# EAGLE design CSS811_BME280_Breakout (EAGLE 9.1.0)
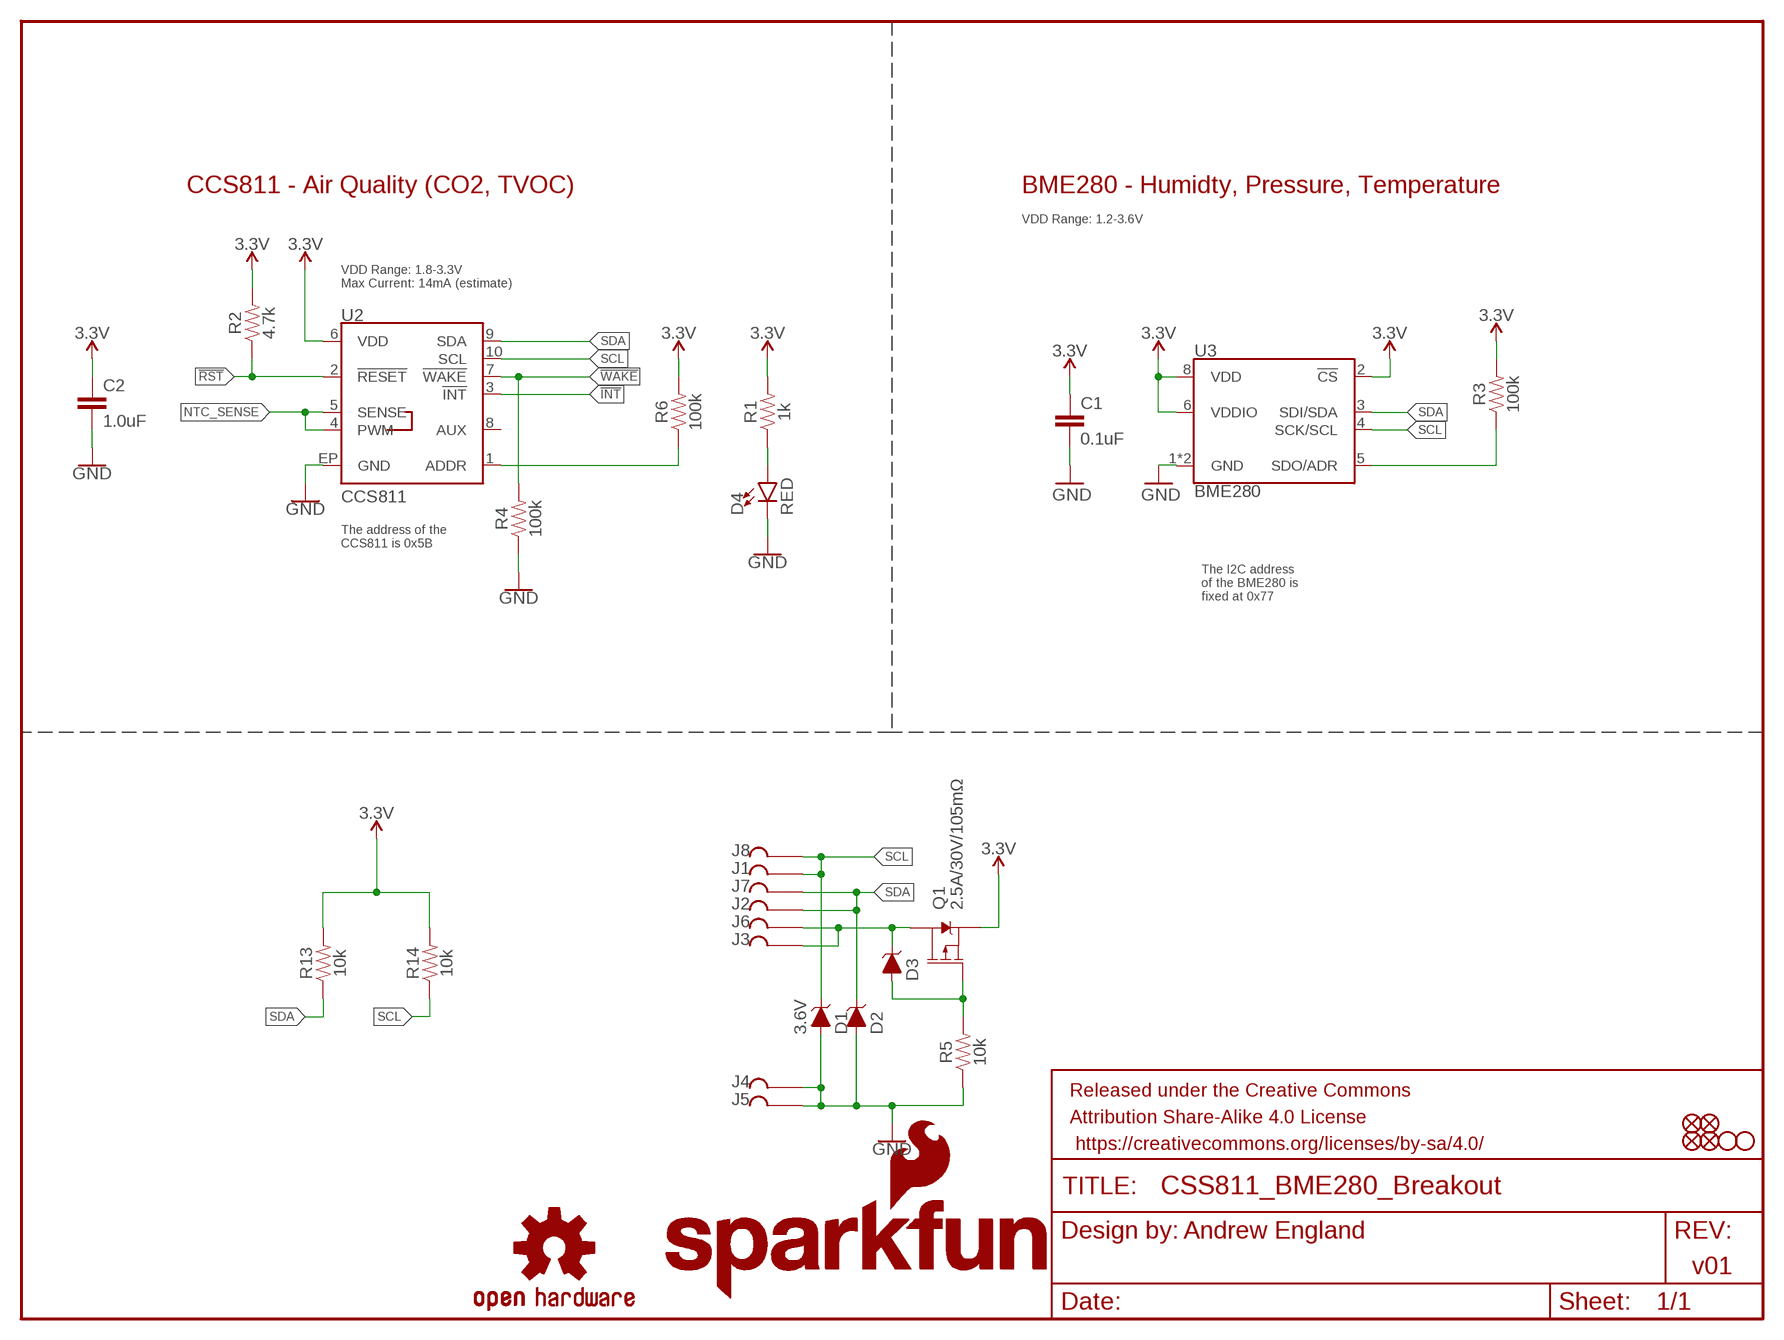
[diagram p0: schematic, sheet 1]

## Parts
C1  0.1uF  0.1UF-0603-25V-(+80/-20%)  [0603]
C2  1.0uF  1.0UF-0603-16V-10%  [0603]
D1  3.6V  DIODE-ZENER-BZT52C3V6S  [SOD-323]
D2  3.6V  DIODE-ZENER-BZT52C3V6S  [SOD-323]
D3  3.6V  DIODE-ZENER-BZT52C3V6S  [SOD-323]
D4  RED  LED-RED0603  [LED-0603]
FD1  FIDUCIAL1X2  [FIDUCIAL-1X2]
FD2  FIDUCIAL1X2  [FIDUCIAL-1X2]
FD3  FIDUCIAL1X2  [FIDUCIAL-1X2]
FD4  FIDUCIAL1X2  [FIDUCIAL-1X2]
FRAME1  FRAME-LETTER  [CREATIVE_COMMONS]
H2  STAND-OFF  [STAND-OFF]
H4  STAND-OFF  [STAND-OFF]
J1  GATORGATOR_MINI  [GATOR_MINI]
J2  GATORGATOR_MINI  [GATOR_MINI]
J3  GATORGATOR_MINI  [GATOR_MINI]
J4  GATORGATOR_MINI  [GATOR_MINI]
J5  GATORGATOR_MINI  [GATOR_MINI]
J6  GATORGATOR_MINI  [GATOR_MINI]
J7  GATORGATOR_MINI  [GATOR_MINI]
J8  GATORGATOR_MINI  [GATOR_MINI]
LOGO1  SFE_LOGO_NAME.1_INCH  [SFE_LOGO_NAME_.1]
LOGO2  SFE_LOGO_NAME_FLAME.1_INCH  [SFE_LOGO_NAME_FLAME_.1]
LOGO4  OSHW-LOGOS  [OSHW-LOGO-S]
Q1  2.5A/30V/105mΩ  MOSFET_PCH-DMG2307L  [SOT23-3]
R1  1k  1KOHM-0603-1/10W-1%  [0603]
R2  4.7k  4.7KOHM-0603-1/10W-1%  [0603]
R3  100k  100KOHM-0603-1/10W-1%  [0603]
R4  100k  100KOHM-0603-1/10W-1%  [0603]
R5  10k  10KOHM-0603-1/10W-1%  [0603]
R6  100k  100KOHM-0603-1/10W-1%  [0603]
R13  10k  10KOHM-0603-1/10W-1%  [0603]
R14  10k  10KOHM-0603-1/10W-1%  [0603]
U2  CCS811  CCS811PRODUCTION  [LGA10]
U3  BME280  [LGA-8-2.5X2.5]

## Nets
3.3V: C1.1 C2.1 Q1.2(S) R1.2 R2.2 R3.2 R6.2 R13.2 R14.2 U2.6(VDD) U3.2(!CS) U3.6(VDDIO) U3.8(VDD)
!INT: U2.3(!INT!)
!RST: R2.1 U2.2(!RESET!)
!WAKE: R4.2 U2.7(!WAKE!)
CCS811_ADDR: R6.1 U2.1(ADDR)
GND: C1.2 C2.2 D1.A D2.A D4.C J4.P$2 J5.P$2 R4.1 R5.1 U2.EP(GND) U3.1(GND) U3.7(GND)
N$2: D4.A R1.1
N$3: D3.C J3.P$2 J6.P$2 Q1.3(D)
N$4: D3.A Q1.1(G) R5.2
NTC_SENSE: U2.4(PWM) U2.5(SENSE)
SCL: D1.C J1.P$2 J8.P$2 R14.1 U2.10(SCL) U3.4(SCK/SCL)
SDA: D2.C J2.P$2 J7.P$2 R13.1 U2.9(SDA) U3.3(SDI/SDA)
SDO/ADR: R3.1 U3.5(SDO/ADR)
Unconnected: U2.8(AUX)

## Notes on the sheet
- CCS811 - Air Quality (CO2, TVOC) | BME280 - Humidty, Pressure, Temperature
- VDD Range: 1.2-3.6V
- VDD Range: 1.8-3.3V
  Max Current: 14mA (estimate)
- The address of the 
  CCS811 is 0x5B
- The I2C address
  of the BME280 is
  fixed at 0x77
- Andrew England
- v01

## Library data of the parts
C1 = SparkFun-Capacitors:0.1UF: 0.1µF ceramic capacitors A capacitor is a passive two-terminal electrical component used to store electrical energy temporarily in an electric field.; PROD_ID: CAP-00810
C2 = SparkFun-Capacitors:1.0UF: 1µF ceramic capacitors A capacitor is a passive two-terminal electrical component used to store electrical energy temporarily in an electric field.; PROD_ID: CAP-00868
D1-D3 = SparkFun-DiscreteSemi:DIODE-ZENER: Zener Diode A Zener diode allows current to flow from its anode to its cathode like a normal semiconductor diode, but it also permits current to flow in the reverse direction when its "Zener voltage" is reached. - WIkipedia; PROD_ID: DIO-08199
D4 = SparkFun-LED:LED-RED: Red SMD LED Used in manufacturing of most products at SparkFun Packages: 0603 - SMD 0603 package [Product Link] <http://docs.avagotech.com/docs/AV02-0551EN> 0603 SMART - SMD 0603 SMART package ( more efficient and expensive)[Product Link] <http://www.osram-os.com/Graphics/XPic2/00077099_0.pdf> 1206 - SMD1206 package [Product Link] <https://www.sparkfun.com/datasheets/DevTools/LilyPad/Q150OVS4.pdff> SparkFun Products: Pro Mini 328 -5V <https://www.sparkfun.com/products/821> RedBoard <https://www.sparkfun.com/products/12757> IOIO-OTG <https://www.sparkfun.com/products/13613>; PROD_ID: DIO-00819
FD1-FD4 = SparkFun-Aesthetics:FIDUCIAL: Fiducial Alignment Points Point-of-reference for pick-and-place machines and other optical instruments.
FRAME1 = SparkFun-Aesthetics:FRAME-LETTER: Schematic Frame - Letter Standard 8.5x11 US Letter frame
H2 H4 = SparkFun-Hardware:STAND-OFF: Stand Off Drill holes for mechanically mounting via screws, standoffs, etc. Note: Use the keepout ring to avoid running the screw head into surrounding components. Variant Overviews STAND-OFF - Mechanical footprint for a #4 phillips button head screw. STAND-OFF-TIGHT - Mechanical footprint for a #4 phillips button head screw, Example SparkFun Products Screw - Phillips Head (1/4", 4-40, 10 pack) <https://www.sparkfun.com/products/10453> (PRT-10453) Screw - Phillips Head (1/2", 4-40, 10 pack) <https://www.sparkfun.com/products/10452> (PRT-10452) Screw - Phillips Head (3/4", 4-40, 10 pack) <https://www.sparkfun.com/products/10451> (PRT-10451) Screw - Phillips Head (1", 4-40, 10 pack) <https://www.sparkfun.com/products/10450> (PRT-10450)
J1-J8 = SparkFun-Connectors:GATOR
LOGO1 = SparkFun-Aesthetics:SFE_LOGO_NAME: SparkFun Font Logo This is the SparkFun name logo. The logo on the schematic will always be the same size; the package variant is the height of the flame part of the logo (or the height the flame would be, if it were drawn). Default layer for the logo on the board is tSilk.
LOGO2 = SparkFun-Aesthetics:SFE_LOGO_NAME_FLAME: SparkFun Font Logo w/ Flame This is the SparkFun full logo. The logo on the schematic will always be the same size; the package variant is the height of the flame part of the logo. Default layer for the logo on the board is tSilk.
LOGO4 = SparkFun-Aesthetics:OSHW-LOGO: Open-Source Hardware (OSHW) Logo This logo indicates the piece of hardware it is found on incorporates a OSHW license and/or adheres to the definition of open source hardware found here: http://freedomdefined.org/OSHW
Q1 = SparkFun-DiscreteSemi:MOSFET_PCH: P-channel MOSFETs Voltage controlled devices that allow control of high current outputs. SparkFun Products: SparkFun ESP32 Thing <https://www.sparkfun.com/products/13907> SparkFun ESP8266 Thing <https://www.sparkfun.com/products/13231>; PROD_ID: TRANS-11308
R1 = SparkFun-Resistors:1KOHM: 1kΩ resistor A resistor is a passive two-terminal electrical component that implements electrical resistance as a circuit element. Resistors act to reduce current flow, and, at the same time, act to lower voltage levels within circuits. - Wikipedia; PROD_ID: RES-07856
R2 = SparkFun-Resistors:4.7KOHM: 4.7kΩ resistor A resistor is a passive two-terminal electrical component that implements electrical resistance as a circuit element. Resistors act to reduce current flow, and, at the same time, act to lower voltage levels within circuits. - Wikipedia; PROD_ID: RES-07857
R3 R4 R6 = SparkFun-Resistors:100KOHM: 100kΩ resistor A resistor is a passive two-terminal electrical component that implements electrical resistance as a circuit element. Resistors act to reduce current flow, and, at the same time, act to lower voltage levels within circuits. - Wikipedia; PROD_ID: RES-07828
R5 R13 R14 = SparkFun-Resistors:10KOHM: 10kΩ resistor A resistor is a passive two-terminal electrical component that implements electrical resistance as a circuit element. Resistors act to reduce current flow, and, at the same time, act to lower voltage levels within circuits. - Wikipedia; PROD_ID: RES-00824
U2 = SparkFun-Sensors:CCS811: AMS CCS811 – I2C Digital Gas Sensor Ultra-Low Power Digital Gas Sensor for Monitoring Indoor Air Quality AMS Product Page <http://ams.com/eng/Products/Environmental-Sensors/Gas-Sensors/CCS811> SparkFun Products:; PROD_ID: IC-13607
U3 = SparkFun-Sensors:BME280: Bosch BME280 – Combined Humidity and Pressure Sensor The BME280 is as combined digital humidity, pressure and temperature sensor based on proven sensing principles. The sensor module is housed in an extremely compact metal-lid LGA package with a footprint of only 2.5×2.5mm² with a height of 0.93mm. Its small dimensions and its low power consumption allow the implementation in battery driven devices such as handsets, GPS modules or watches. Datasheet <https://cdn.sparkfun.com/assets/learn_tutorials/4/1/9/BST-BME280_DS001-10.pdf> SparkFun Products SparkFun Atmospheric Sensor Breakout - BME280 <https://www.sparkfun.com/products/13676> (SEN-13676); PROD_ID: IC-13090

## Board
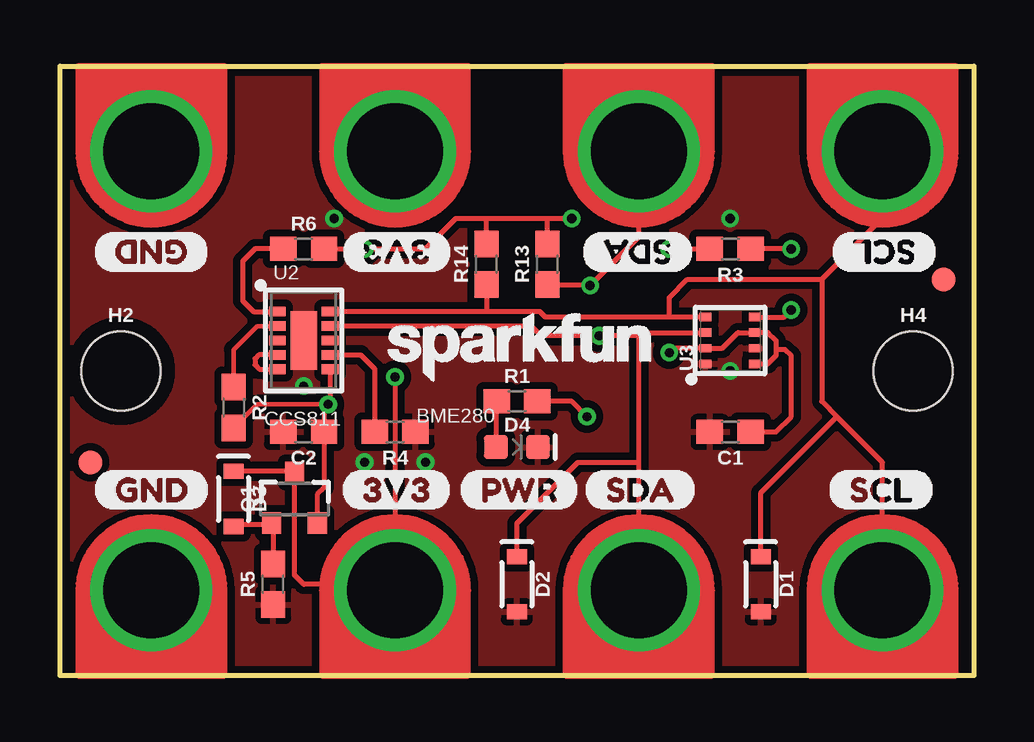
[diagram p1: board, top side]
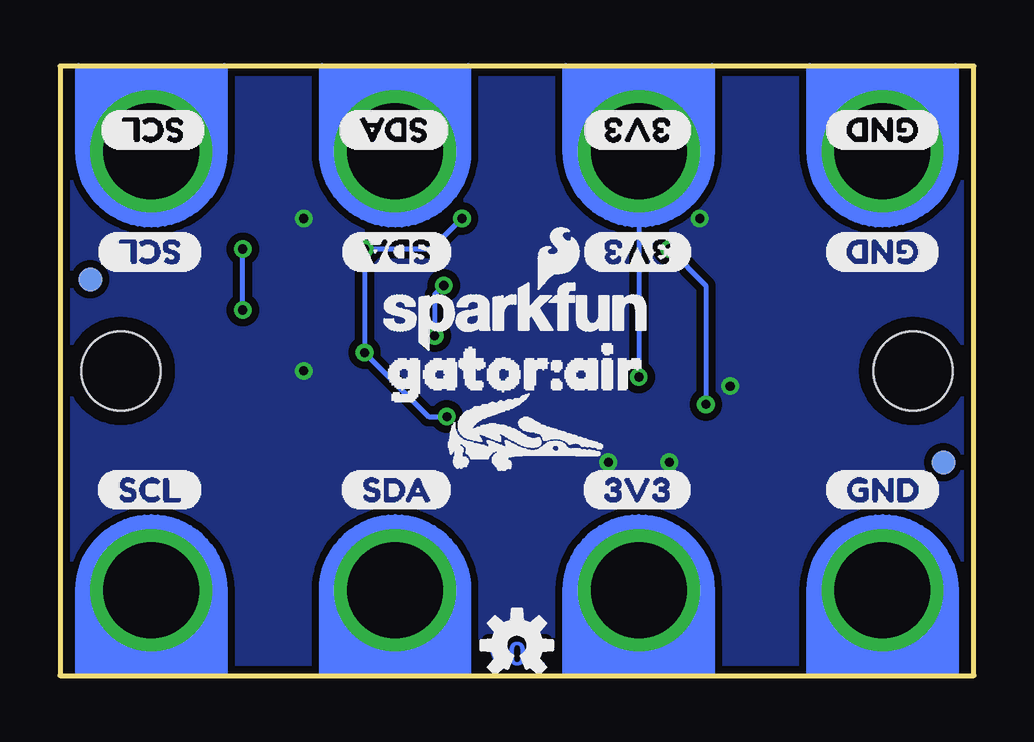
[diagram p2: board, bottom side, seen from below]

Size 38.1 x 25.4 mm. Coordinates in mm from the lower left corner, seen from the top.
Outline: 0,0 0,25.4 38.1,25.4 38.1,0 0,0
Copper layers (1*16): Top 0.035mm / dielectric 1.5mm / Bottom 0.035mm
Design rules "SparkFun-2-layer-TIGHT": minimum track width 7mil, minimum drill 15mil, track to track 7mil, track to pad 7mil, pad to pad 7mil, via to via 7mil, smd to smd 7mil, copper to edge 7mil, drill to drill 7mil, minimum pad ring 7mil, minimum via ring 7mil, stop-mask expansion 4mil, vias tented up to drill 25mil, thermal gap 10mil

### Footprints (pad centres in the part's own frame; a part is rotated, then mirrored left to right if it is on the bottom)
0603 = smd 1.1 x 1: 1 -0.85,0; 2 0.85,0
SOD-323 = smd 0.63 x 0.83: A 1.15,0; C -1.15,0
LED-0603 = smd 1 x 1: A -0.877,0; C 0.877,0
FIDUCIAL-1X2 = smd 1 x 1: 1 0,0
STAND-OFF = hole 3.302: 0,0
GATOR_MINI = drill 4 pad 5.08: P$2 0,-0.254
SOT23-3 = smd 0.8 x 0.9: 1 -0.95,-1; 2 0.95,-1; 3 0,1.1
LGA10 = smd 0.7 x 0.4: 1 -1.1,1.2; 2 -1.1,0.6; 3 -1.1,0; 4 -1.1,-0.6; 5 -1.1,-1.2; 6 1.1,-1.2; 7 1.1,-0.6; 8 1.1,0; 9 1.1,0.6; 10 1.1,1.2 | smd 1.1 x 2.45: EP 0,0
LGA-8-2.5X2.5 = smd 0.35 x 0.5: 1 -0.975,1.025; 2 -0.325,1.025; 3 0.325,1.025; 4 0.975,1.025; 5 0.975,-1.025; 6 0.325,-1.025; 7 -0.325,-1.025; 8 -0.975,-1.025

### Placement (x,y rotation side)
C1  27.94,10.16 180 top
C2  10.16,10.16 180 top
D1  29.21,3.81 270 top
D2  19.05,3.81 270 top
D3  7.24,7.37 270 top
D4  19.05,9.53 0 top
FD1  36.83,16.51 0 top
FD2  1.27,8.89 0 top
FD3  1.27,8.89 0 bottom
FD4  36.83,16.51 0 bottom
FRAME1  -13.97,-21.59 0 top  (outside the outline)
H2  2.54,12.7 0 top
H4  35.56,12.7 0 top
J1  34.29,3.81 0 top
J2  24.13,3.81 0 top
J3  13.97,3.81 0 top
J4  3.81,3.81 0 top
J5  3.81,21.59 180 top
J6  13.97,21.59 180 top
J7  24.13,21.59 180 top
J8  34.29,21.59 180 top
LOGO1  19.18,13.68 0 top
LOGO2  19.05,14.99 0 bottom
LOGO4  19.05,1.27 0 bottom
Q1  9.78,7.37 0 top
R1  19.05,11.43 0 top
R2  7.24,11.18 270 top
R3  27.94,17.78 180 top
R4  13.97,10.16 180 top
R5  8.89,3.81 90 top
R6  10.16,17.78 0 top
R13  20.32,17.14 90 top
R14  17.78,17.14 90 top
U2  10.16,13.97 0 top
U3  27.94,13.97 90 top
U$1  [3V33]  11.68,7.75 0 top
U$2  [GND0]  1.4,7.75 0 top
U$3  [SCL2]  32,7.75 0 top
U$4  [SDA1]  21.84,7.75 0 top
U$5  [SDA1]  26.42,17.65 180 top
U$6  [SCL2]  36.58,17.65 180 top
U$7  [GND0]  6.22,17.65 180 top
U$8  [3V33]  16.38,17.65 180 top
U$9  [3V33]  11.68,22.73 180 bottom
U$10  [GND0]  1.4,22.73 180 bottom
U$11  [SCL2]  32,22.73 180 bottom
U$12  [SDA1]  21.84,22.73 180 bottom
U$13  [SDA1]  26.42,7.75 0 bottom
U$14  [SCL2]  36.58,7.75 0 bottom
U$15  [GND0]  6.22,7.75 0 bottom
U$16  [3V33]  16.38,7.75 0 bottom
U$17  [GATOR#AIR0]  26.04,12.83 0 bottom
U$18  [PWR0]  16.64,7.75 0 top
U$19  [GATORBIT_FINAL_FOR_SILK#01#PNG]  18.67,10.16 0 bottom
U$20  [GND0]  1.4,17.65 180 bottom
U$21  [3V33]  11.68,17.65 180 bottom
U$22  [SDA1]  21.72,17.65 180 bottom
U$23  [SCL2]  32.13,17.65 180 bottom
U$24  [ORDERING_INSTRUCTIONS]  -8.89,-24.13 0 top  (outside the outline)

### Tracks (layer width: path | path; a pad name or v marks a point on that pad's centre or on a via)
3.3V  (via drill 0.38)
  Top 0.178: v11.18,11.3 8.22,11.3 R2.2
  Top 0.203: U3.8 29.5,12.99 29.84,13.34 29.84,13.59 | 29.84,13.59 29.84,13.97 29.52,14.29 U3.6 28.27,14.29 27.61,13.64 U3.2 25.58,13.64 v25.4,13.46 | C1.1 29.84,10.16 30.48,10.79 30.48,13.34 30.23,13.59 29.84,13.59 | U2.6 11.26,11.39 v11.18,11.3 11.01,11.14 C2.1 11.01,7.83 10.73,7.55 Q1.2 | v25.4,17.78 R3.2 | R6.2 v12.7,17.78 15.24,17.78 16.51,19.05 17.78,19.05 | 17.78,19.05 20.32,19.05 | 20.32,19.05 v21.34,19.05 | R14.2 17.78,19.05 | R13.2 20.32,19.05 | R1.2 21.34,11.43 v21.97,10.79
  Bottom 0.203: v12.7,17.78 11.18,16.26 v11.18,11.3 | v21.34,19.05 22.61,17.78 v25.4,17.78 v25.4,13.46 22.73,10.79 v21.97,10.79
!RST
  Top 0.178: U2.2 8.22,14.57 7.24,13.59 R2.1
!WAKE
  Top 0.203: U2.7 12.54,13.37 13.12,12.79 R4.2
CCS811_ADDR
  Top 0.203: U2.1 8.07,15.17 7.62,15.62 7.62,17.27 8.13,17.78 R6.1
GND  (via drill 0.38)
  other vias: 11.43,19.05 27.94,19.05 27.94,12.7 10.16,12.06 12.7,8.89 15.24,8.89
  pour Top (isolate 0.305): 0,0 38.1,0 38.1,25.4 0,25.4
  pour Bottom (isolate 0.305): 0,25.4 38.1,25.4 38.1,0 0,0
N$2
  Top 0.203: R1.1 18.17,11.4 D4.A
N$3  (via drill 0.38)
  Top 0.203: D3.C 9.73,8.52 Q1.3 9.78,4.19 10.16,3.81 13.72,3.81 13.84,3.68 | J3.P$2 13.84,3.68 | v13.97,12.45 13.97,3.81 13.84,3.68
  Bottom 0.203: J6.P$2 v13.97,12.45
N$4
  Top 0.203: Q1.1 8.89,6.3 | 8.89,6.3 R5.2 | D3.A 7.33,6.3 8.89,6.3
NTC_SENSE
  Top 0.203: U2.4 8.29,13.37 8.13,13.21 8.13,12.95 8.31,12.77 U2.5
SCL
  Top 0.203: U3.4 25.4,14.95 | 25.4,14.95 20.23,14.95 20.01,15.17 17.78,15.17 | 17.78,15.17 U2.10 | J8.P$2 34.29,19.05 31.75,16.51 | 31.75,16.51 31.75,11.43 32.38,10.79 | 32.38,10.79 34.29,8.89 J1.P$2 | 25.4,14.95 25.4,15.75 26.16,16.51 31.75,16.51 | R14.1 17.78,15.17 | D1.C 29.21,7.62 32.38,10.79
SDA  (via drill 0.38)
  Top 0.203: U2.9 19.65,14.57 20.05,14.17 v22.48,14.17 24.13,14.17 | J7.P$2 24.13,19.05 24.13,18.29 v22.1,16.26 22.06,16.3 R13.1 | 24.13,8.89 24.13,14.17 | 24.13,14.17 24.26,14.29 U3.3 | D2.C 19.05,6.35 21.59,8.89 24.13,8.89 | J2.P$2 24.13,8.89
  Bottom 0.203: v22.48,14.17 22.48,15.88 v22.1,16.26
SDO/ADR  (via drill 0.38)
  Top 0.203: U3.5 30.18,14.95 v30.48,15.24 | v30.48,17.78 R3.1
  Bottom 0.203: v30.48,15.24 v30.48,17.78

### Text on the board
Bottom: v01
tNames: BME280 | CCS811
tDocu: Andrew England | Black Gloss Soldermask